# Altium project EVL2.PrjPcb
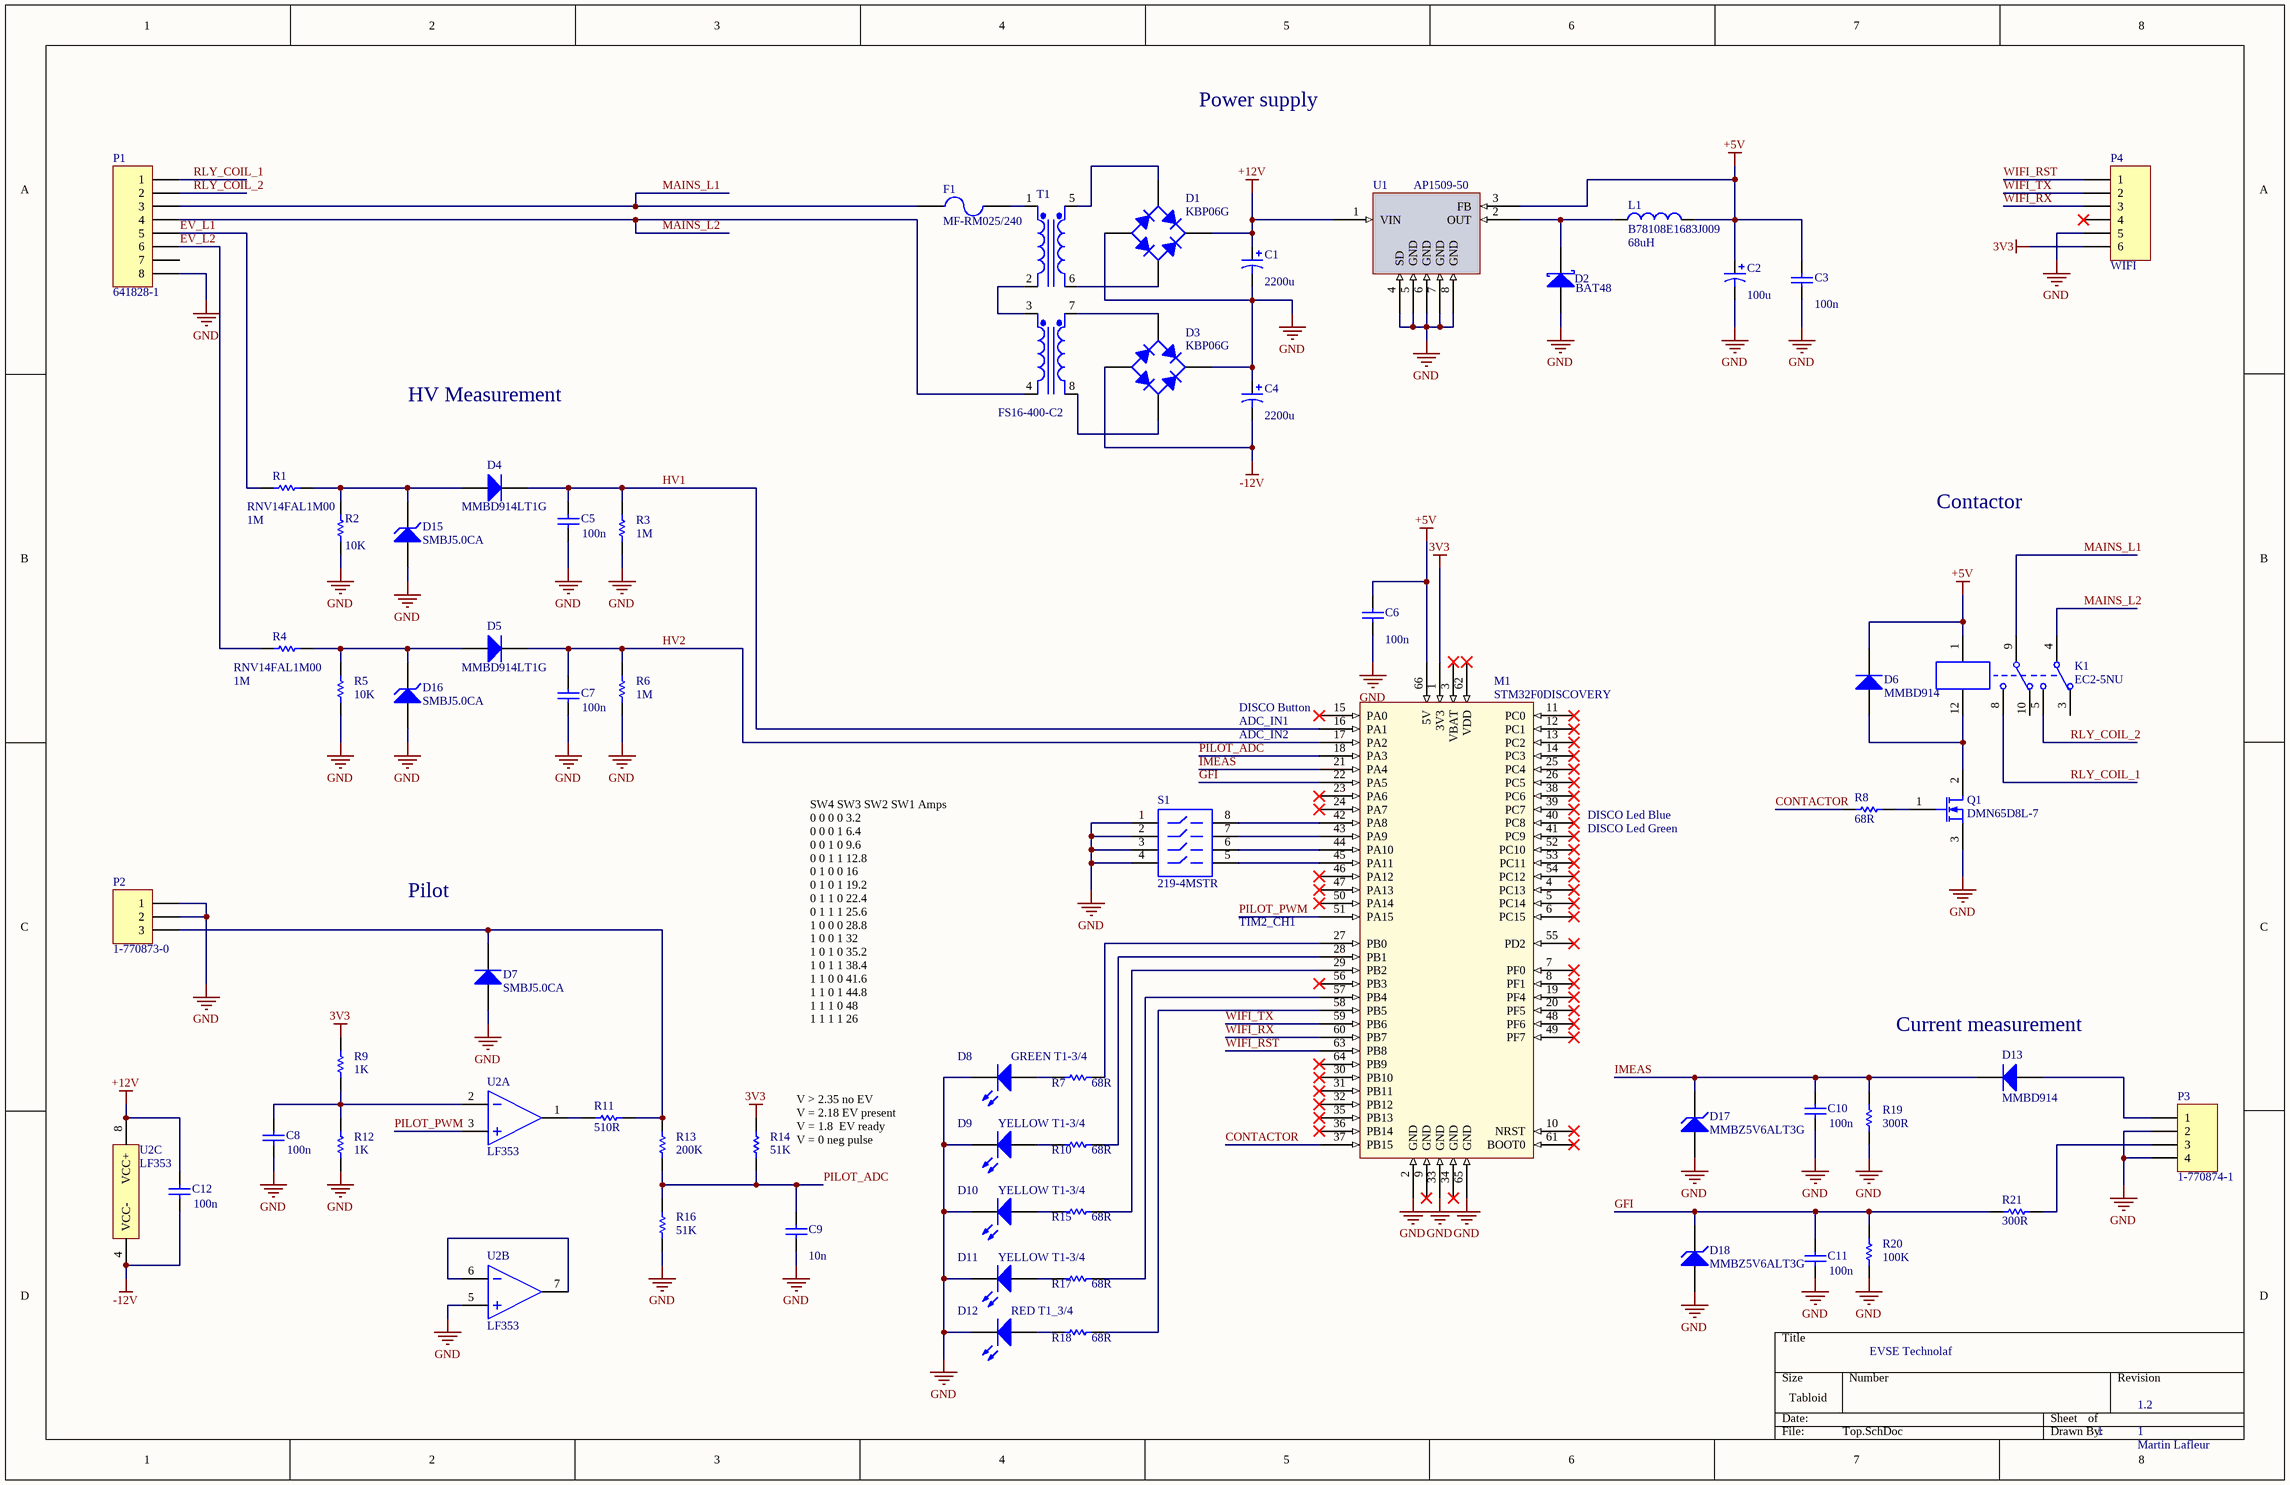
[diagram p0: Top.SchDoc]
1 sheet, 63 parts. Net scope: global (net labels, ports and power ports of the same name join across sheets).
Board file: PCB1.PcbDoc

## Sheet Top.SchDoc: EVSE Technolaf
size Tabloid; DrawnBy: Martin Lafleur; Revision: 1.0; SheetNumber: 1; SheetTotal: 1

### Parts
C1  value 2200u  [RB7.6-15]  (hidden comment: Cap Pol1)
C2  value 100u  [RB0.1]  (hidden comment: Cap Pol1)
C3  value 100n  [6-0805_M]  (hidden comment: Cap)
C4  2200u  [RB7.6-15]
C5  value 100n  [6-0805_M]  (hidden comment: Cap)
C6  value 100n  [6-0805_M]  (hidden comment: Cap)
C7  value 100n  [6-0805_M]  (hidden comment: Cap)
C8  value 100n  [6-0805_M]  (hidden comment: Cap)
C9  value 10n  [6-0805_M]  (hidden comment: Cap)
C10  value 100n  [6-0805_M]  (hidden comment: Cap)
C11  value 100n  [6-0805_M]  (hidden comment: Cap)
C12  value 100n  [6-0805_M]  (hidden comment: Cap)
D1  KBP06G  [KBP06M]
D2  BAT48  [AXIAL-0.6]
D3  KBP06G  [KBP06M]
D4  MMBD914LT1G  [SOT23_914]
D5  MMBD914LT1G  [SOT23_914]
D6  MMBD914  [SOT23_914]
D7  SMBJ5.0CA  [SMB]
D8  GREEN T1-3/4  [LED_T13/4]
D9  YELLOW T1-3/4  [LED_T13/4]
D10  YELLOW T1-3/4  [LED_T13/4]
D11  YELLOW T1-3/4  [LED_T13/4]
D12  RED T1_3/4  [LED_T13/4]
D13  MMBD914  [SOT23_914]
D15  SMBJ5.0CA  [SMB]
D16  SMBJ5.0CA  [SMB]
D17  MMBZ5V6ALT3G  [SOT23_914]
D18  MMBZ5V6ALT3G  [SOT23_914]
F1  MF-RM025/240  [MF-RM025/240]
K1  EC2-5NU  [EC2-5NU]
L1  B78108E1683J009  value 68uH  [AXIAL-0.6]
M1  STM32F0DISCOVERY  [STM32F0DISCO]
P1  641828-1  [641828-1]
P2  1-770873-0  [MATENLOK_1X3]
P3  1-770874-1  [MATENLOK_2X2]
P4  WIFI  [HDR1X6]
Q1  DMN65D8L-7  [SOT23_914]
R1  RNV14FAL1M00  value 1M  [AXIAL-0.6]
R2  value 10K  [6-0805_M]  (hidden comment: Res1)
R3  value 1M  [6-0805_M]  (hidden comment: Res1)
R4  RNV14FAL1M00  value 1M  [AXIAL-0.6]
R5  value 10K  [6-0805_M]  (hidden comment: Res1)
R6  value 1M  [6-0805_M]  (hidden comment: Res1)
R7  value 68R  [6-0805_M]  (hidden comment: Res1)
R8  value 68R  [6-0805_M]  (hidden comment: Res1)
R9  value 1K  [6-0805_M]  (hidden comment: Res1)
R10  value 68R  [6-0805_M]  (hidden comment: Res1)
R11  value 510R  [6-0805_M]  (hidden comment: Res1)
R12  value 1K  [6-0805_M]  (hidden comment: Res1)
R13  value 200K  [6-0805_M]  (hidden comment: Res1)
R14  value 51K  [6-0805_M]  (hidden comment: Res1)
R15  value 68R  [6-0805_M]  (hidden comment: Res1)
R16  value 51K  [6-0805_M]  (hidden comment: Res1)
R17  value 68R  [6-0805_M]  (hidden comment: Res1)
R18  value 68R  [6-0805_M]  (hidden comment: Res1)
R19  value 300R  [6-0805_M]  (hidden comment: Res1)
R20  value 100K  [6-0805_M]  (hidden comment: Res1)
R21  value 300R  [6-0805_M]  (hidden comment: Res1)
S1  219-4MSTR  [DIPSW4]
T1  FS16-400-C2  [FS16-400-C2]
U1  AP1509-50  [SO8_N]
U2  LF353  [SO8_N]  (parts A,B,C of 3)

### Nets
3V3: M1.1(3V3) P4.6 R9.2 R14.2
+5V: C2.1 C3.2 C6.2 D6.2(K) K1.1 L1.2 M1.66(5V) U1.3(FB)
+12V: C1.1 C12.2 D1.1(K) U1.1(VIN) U2.8(VCC+)
-12V: C4.2 C12.1 D3.3(A) U2.4(VCC-)
GND: C1.2 C2.2 C3.1 C4.1 C5.1 C6.1 C7.1 C8.1 C9.1 C10.1 C11.1 D1.3(A) D2.1(A) D3.1(K) D7.1(A) D8.2(K) D9.2(K) D10.2(K) D11.2(K) D12.2(K) D15.1(A) D16.1(A) D17.1(A) D18.1(A) M1.2(GND) M1.33(GND) M1.65(GND) P1.8 P2.1 P2.2 P3.2 P3.4 P4.5 Q1.3(S) R2.1 R3.1 R5.1 R6.1 R12.1 R16.1 R19.1 R20.1 S1.1 S1.2 S1.3 S1.4 U1.4(SD) U1.5(GND) U1.6(GND) U1.7(GND) U1.8(GND) U2.5(IN+)
CONTACTOR: M1.37(PB15) R8.2
EV_L1: P1.5 R1.2
EV_L2: P1.6 R4.2
GFI: C11.2 D18.2(K) M1.22(PA5) R20.2 R21.2
HV1: C5.2 D4.2(K) M1.16(PA1) R3.2
HV2: C7.2 D5.2(K) M1.17(PA2) R6.2
IMEAS: C10.2 D13.2(K) D17.2(K) M1.21(PA4) R19.2
MAINS_L1: F1.1 K1.9 P1.3
MAINS_L2: K1.4 P1.4 T1.4(Pri2-)
PILOT_ADC: C9.2 M1.18(PA3) R13.1 R14.1 R16.2
PILOT_PWM: M1.51(PA15) U2.3(IN+)
RLY_COIL_1: K1.8 P1.1
RLY_COIL_2: K1.5 P1.2
WIFI_RST: M1.63(PB8) P4.1
WIFI_RX: M1.60(PB7) P4.3
WIFI_TX: M1.59(PB6) P4.2
NetC8_2: C8.2 R9.1 R12.2 U2.2(IN-)
NetD1_2: D1.2(C) T1.6(Sec1-)
NetD1_4: D1.4(C) T1.5(Sec1+)
NetD2_2: D2.2(K) L1.1 U1.2(OUT)
NetD3_2: D3.2(C) T1.8(Sec2-)
NetD3_4: D3.4(C) T1.7(Sec2+)
NetD4_1: D4.1(A) D15.2(K) R1.1 R2.2
NetD5_1: D5.1(A) D16.2(K) R4.1 R5.2
NetD6_1: D6.1(A) K1.12 Q1.2(D)
NetD7_2: D7.2(K) P2.3 R11.1 R13.2
NetD8_1: D8.1(A) R7.2
NetD9_1: D9.1(A) R10.2
NetD10_1: D10.1(A) R15.2
NetD11_1: D11.1(A) R17.2
NetD12_1: D12.1(A) R18.2
NetD13_1: D13.1(A) P3.1
NetF1_2: F1.2 T1.1(Pri+)
NetM1_27: M1.27(PB0) R7.1
NetM1_28: M1.28(PB1) R10.1
NetM1_29: M1.29(PB2) R15.1
NetM1_42: M1.42(PA8) S1.8
NetM1_43: M1.43(PA9) S1.7
NetM1_44: M1.44(PA10) S1.6
NetM1_45: M1.45(PA11) S1.5
NetM1_57: M1.57(PB4) R17.1
NetM1_58: M1.58(PB5) R18.1
NetP3_3: P3.3 R21.1
NetQ1_1: Q1.1(G) R8.1
NetR11_2: R11.2 U2.1(OUT)
NetT1_2: T1.2(Pri-) T1.3(Pri2+)
NetU2_6: U2.6(IN-) U2.7(OUT)

Not connected (* = marked no-connect by the designer): K1 3 10; M1 3(VBAT)* 4(PC13)* 5(PC14)* 6(PC15)* 7(PF0)* 8(PF1)* 9(GND)* 10(NRST)* 11(PC0)* 12(PC1)* 13(PC2)* 14(PC3)* 15(PA0)* 19(PF4)* 20(PF5)* 23(PA6)* 24(PA7)* 25(PC4)* 26(PC5)* 30(PB10)* 31(PB11)* 32(PB12)* 34(GND)* 35(PB13)* 36(PB14)* 38(PC6)* 39(PC7)* 40(PC8)* 41(PC9)* 46(PA12)* 47(PA13)* 48(PF6)* 49(PF7)* 50(PA14)* 52(PC10)* 53(PC11)* 54(PC12)* 55(PD2)* 56(PB3)* 61(BOOT0)* 62(VDD)* 64(PB9)*; P1 7; P4 4*

### Notes on the sheet
- Power supply
- HV Measurement
- Contactor
- (near M1) DISCO Button
- ADC_IN1
- ADC_IN2
- DISCO Led Blue
- DISCO Led Green
- Pilot
- TIM2_CH1
- SW4	SW3	SW2	SW1	Amps
  0	0	0	0	3.2
  0	0	0	1	6.4
  0	0	1	0	9.6
  0	0	1	1	12.8
  0	1	0	0	16
  0	1	0	1	19.2
  0	1	1	0	22.4
  0	1	1	1	25.6
  1	0	0	0	28.8
  1	0	0	1	32
  1	0	1	0	35.2
  1	0	1	1	38.4
  1	1	0	0	41.6
  1	1	0	1	44.8
  1	1	1	0	48
  1	1	1	1	26
- (near D13) Current measurement
- (near R14) V > 2.35	no EV
  V = 2.18	EV present
  V = 1.8  EV ready
  V = 0	neg pulse
- EVSE Technolaf
- 1
- 1.2
- Martin Lafleur

### Library data of the parts
C1 C2 C4 = Cap Pol1: Polarized Capacitor (Radial); Published: 8-Jun-2000; LatestRevisionDate: 17-Jul-2002; LatestRevisionNote: Re-released for DXP Platform.; PackageReference: RB7.6-15; Publisher: Altium Limited; PackageDescription: Polarized Capacitor (Radial); 2 Leads
  C4: Value: 2200u
C3 C5-C12 = Cap: Capacitor; Published: 8-Jun-2000; LatestRevisionDate: 17-Jul-2002; LatestRevisionNote: Re-released for DXP Platform.; PackageReference: RAD-0.3; Publisher: Altium Limited; PackageDescription: Radial Cap, Thru-Hole; 2 Leads; 0.3 in Pin Spacing
D1 D3 = Bridge1: Full Wave Diode Bridge; Published: 8-Jun-2000; LatestRevisionDate: 29-May-2009; LatestRevisionNote: Sch pins A & K swapped.; DatasheetVersion: E2732B; PackageReference: D-38; Publisher: Altium Limited; PackageDescription: Bridge Rectifier; 4 Terminals; Body 9.4 x 9.4 mm (typ); Pitch 5.08 mm
D2 = D Schottky: Schottky Diode; Published: 8-Jun-2000; LatestRevisionDate: 17-Jul-2002; LatestRevisionNote: Re-released for DXP Platform.; PackageReference: SMB; Publisher: Altium Limited; PackageDescription: DO-214-AA/SMB; 2 C-Bend Leads; Body 5.3 x 3.6 mm, inc. leads (LxW); Code_JEDEC: DO-214-AA
D4-D7 D13 = Diode: Default Diode; Published: 8-Jun-2000; LatestRevisionDate: 17-Jul-2002; LatestRevisionNote: Re-released for DXP Platform.; PackageVersion: Sep-1996; PackageReference: SMC; Publisher: Altium Limited; PackageDescription: DO-214-AB/SMC; 2 C-Bend Leads; Body 7.9 x 5.9 mm, inc. leads (LxW); Code_JEDEC: DO-214-AB
D8-D11 = LED0: Typical INFRARED GaAs LED; Published: 8-Jun-2000; LatestRevisionDate: 08-Jul-2005; LatestRevisionNote: Mech Layer 1 removed.; PackageReference: LED-0; Publisher: Altium Limited; PackageDescription: LED; 2 Leads
D12 = LED0: RED; Published: 8-Jun-2000; LatestRevisionDate: 08-Jul-2005; LatestRevisionNote: Mech Layer 1 removed.; PackageReference: LED-0; Publisher: Altium Limited; PackageDescription: LED; 2 Leads
D15-D18 = D Zener: Zener Diode; Published: 8-Jun-2000; LatestRevisionDate: 17-Jul-2002; LatestRevisionNote: Re-released for DXP Platform.; PackageReference: DIODE-0.7; Publisher: Altium Limited; PackageDescription: Diode, Thru-Hole; 2 Leads; 0.7 in Pin Spacing
F1 = Fuse 2: MF-RM025/240-2; Published: 8-Jun-2000; LatestRevisionDate: 17-Jul-2002; LatestRevisionNote: Re-released for DXP Platform.; PackageReference: PIN-W2/E2.8; Publisher: Altium Limited; PackageDescription: Thru-Hole; 2 Leads
K1 = Relay-DPDT: Dual-Pole Dual-Throw Relay; Published: 24-Mar-1999; LatestRevisionDate: 17-Jul-2002; LatestRevisionNote: Re-released for DXP Platform.; PackageReference: DIP-P8; Publisher: Altium Limited; PackageDescription: Relay; 8 Leads
L1 = Inductor: Code_IEC: 1005; Published: 8-Jun-2000; LatestRevisionDate: 29-May-2009; LatestRevisionNote: IPC-7351 Footprint Added.; PackageReference: 0402-A; Publisher: Altium Limited; PackageDescription: Chip Inductor; Code_JEITA: 0402
P1 = Header 8: Header, 8-Pin; LatestRevisionDate: 17-Jul-2002; LatestRevisionNote: Re-released for DXP Platform.; Publisher: Altium Limited
P2 = Header 3: Header, 3-Pin; LatestRevisionDate: 17-Jul-2002; LatestRevisionNote: Re-released for DXP Platform.; Publisher: Altium Limited
P3 = Header 4: Header, 4-Pin; LatestRevisionDate: 17-Jul-2002; LatestRevisionNote: Re-released for DXP Platform.; Publisher: Altium Limited
P4 = Header 6: Header, 6-Pin; LatestRevisionDate: 17-Jul-2002; LatestRevisionNote: Re-released for DXP Platform.; Publisher: Altium Limited
Q1 = MOSFET-N: N-Channel MOSFET; Published: 8-Jun-2000; LatestRevisionDate: 17-Jul-2002; LatestRevisionNote: Re-released for DXP Platform.; PackageVersion: 1995/1996; PackageReference: E3; Publisher: Altium Limited; PackageDescription: TO, Flat Index; 3 In-Line, Axial Leads; Body Dia. 4.6mm; Lead Dia. 0.5 mm (max)
R1-R21 = Res1: Resistor; Published: 8-Jun-2000; LatestRevisionDate: 17-Jul-2002; LatestRevisionNote: Re-released for DXP Platform.; PackageReference: AXIAL-0.3; Publisher: Altium Limited; PackageDescription: Axial Device, Thru-Hole; 2 Leads; 0.3 in Pin Spacing
S1 = SW-DIP4: DIP Switch; Published: 24-Mar-1999; LatestRevisionDate: 17-Jul-2002; LatestRevisionNote: Re-released for DXP Platform.; PackageReference: DIP-8; Publisher: Altium Limited
T1 = TRANSFO_2p2s
U1 = AP1509
U2 = LM358P: IC OPAMP GP 700KHZ 8DIP; Manufacturer: Texas Instruments; Emplacement: OP AMP TUBE; Amplifier Type: General Purpose; Number of Circuits: 2; Slew Rate: 0.3 V/µs; Current - Input Bias: 20nA; Voltage - Input Offset: 3mV; Current - Supply: 1mA; Current - Output / Channel: 30mA; Voltage - Supply, Single/Dual (±): 3 V ~ 32 V, ±1.5 V ~ 16 V; Supplier 1: Digi-Key; Manufacturer Part Number: LM358P; RoHS: RoHS Compliant; Category: Integrated Circuits (ICs); Stock 1: 12094; Pricing 1: 1=0.58, 10=0.45, 25=0.3788, 100=0.3085, 250=0.25568, 500=0.21156, 750=0.17631, 1000=0.15867 (CAD); Packaging: Tube; Output Type: -; Gain Bandwidth Product: 700kHz; -3db Bandwidth: -; Operating Temperature: 0°C ~ 70°C; Mounting Type: Through Hole; Package / Case: 8-DIP (0.300", 7.62mm); Supplier Device Package: 8-PDIP; ComponentLink1URL: http://www.ti.com/lit/ds/symlink/lm358.pdf; ComponentLink1Description: http://www.ti.com/lit/ds/symlink/lm358.pdf; Supplier Part Number 1: 296-1395-5-ND